# EAGLE schematic MotorAndLight (EAGLE 7.7.0)

## Sheet 1 of 7

## Sheet 2 of 7
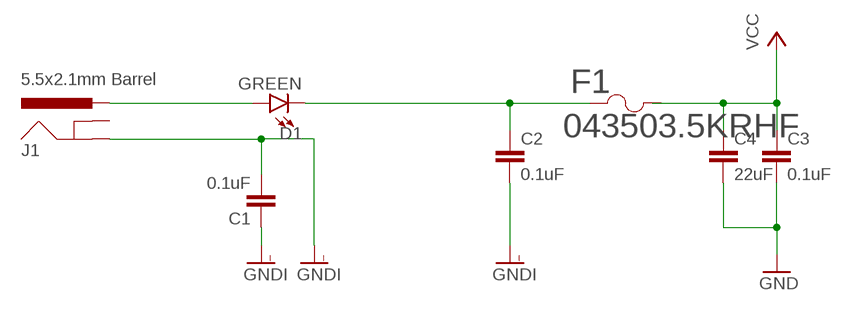
[diagram p0: schematic, sheet 2]

### Parts
C1  0.1uF  0.1UF-0603-25V-(+80/-20%)  [0603]
C2  0.1uF  0.1UF-0603-25V-(+80/-20%)  [0603]
C3  0.1uF  0.1UF-0603-25V-(+80/-20%)  [0603]
C4  22uF  22UF-0805-6.3V-20%  [0805]
D1  GREEN  LED-GREEN0603  [LED-0603]
F1  043503.5KRHF  [0435SERIES]
J1  5.5x2.1mm Barrel  POWER_JACKSMD  [POWER_JACK_SMD]

### Nets
GND: C3.2 C4.2 ; also sheet 4,5,6
GNDI: C1.1 C1.2 C2.2 J1.P$4(GND)
N$1: D1.A J1.VIN0(PWR)
N$4: C2.1 D1.C F1.1
VCC: C3.1 C4.1
Unconnected: F1.2 J1.GND(GNDBREAK)

## Sheet 3 of 7

## Sheet 4 of 7
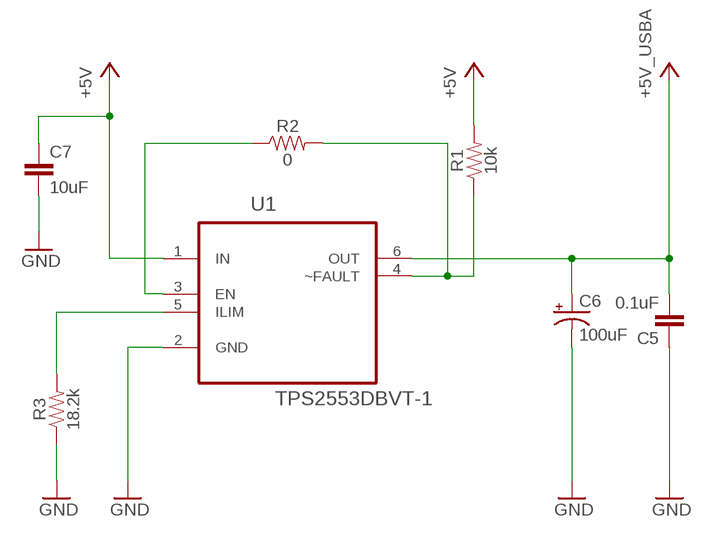
[diagram p1: schematic, sheet 4]

### Parts
C5  0.1uF  0.1UF-0603-25V-(+80/-20%)  [0603]
C6  100uF  100UF-POLAR-EIA7343-16V-10%(TANT)  [EIA7343]
C7  10uF  10UF-0603-6.3V-20%  [0603]
R1  10k  10KOHM-0603-1/10W-1%  [0603]
R2  0  0OHM-0603-1/10W-5%  [0603]
R3  18.2k  20KOHM-0603-1/10W-1%  [0603]
U1  TPS2553DBVT-1  [SOT95P280X145-6N]

### Nets
+5V: C5.2 C6.A(+) C7.1 R1.2 U1.1(IN) U1.6(OUT) ; supply symbol labelled +5V_USBA
GND: C5.1 C6.C(-) C7.2 R3.1 U1.2(GND) ; also sheet 2,5,6
N$6: R3.2 U1.5(ILIM)
USB3_CONN_EN: R2.1 U1.3(EN)
USB3_CONN_FLT: R1.1 R2.2 U1.4(~FAULT)

## Sheet 5 of 7
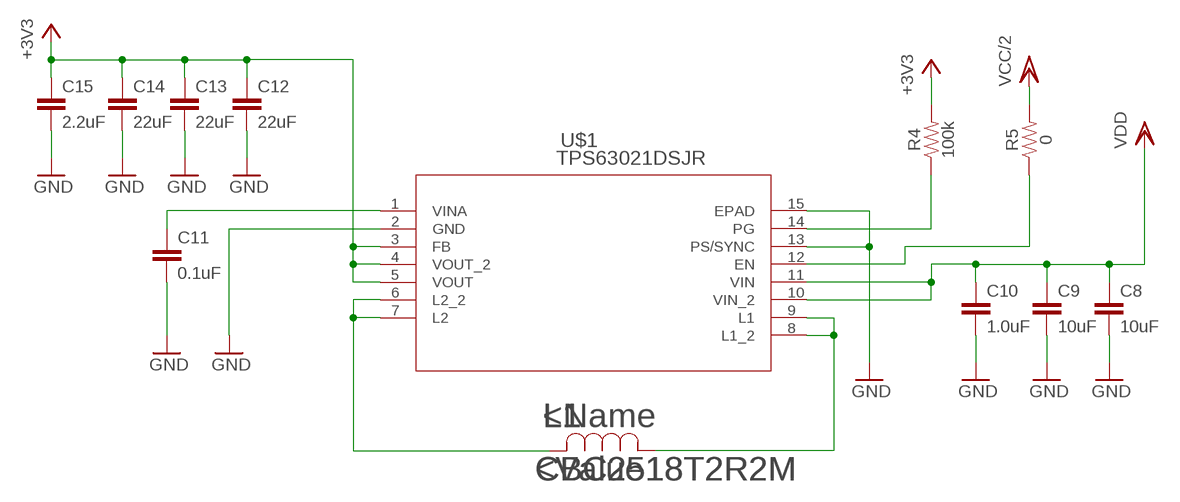
[diagram p2: schematic, sheet 5]

### Parts
C8  10uF  10UF-0603-6.3V-20%  [0603]
C9  10uF  10UF-0603-6.3V-20%  [0603]
C10  1.0uF  1.0UF-0603-16V-10%  [0603]
C11  0.1uF  0.1UF-0603-25V-(+80/-20%)  [0603]
C12  22uF  22UF-0805-6.3V-20%  [0805]
C13  22uF  22UF-0805-6.3V-20%  [0805]
C14  22uF  22UF-0805-6.3V-20%  [0805]
C15  2.2uF  2.2UF-0603-10V-20%  [0603]
L1  CBC2518T2R2M  [IND_TAIYO_CBC2518]
R4  100k  100KOHM-0603-1/10W-1%  [0603]
R5  0  0OHM-0603-1/10W-5%  [0603]
U$1  TPS63021DSJR  [DSJ14_2P85X1P58]

### Nets
+3.3V_SW_L1: L1.1 U$1.8(L1_2) U$1.9(L1)
+3.3V_SW_L2: L1.2 U$1.6(L2_2) U$1.7(L2)
+3.3V_VINA: C11.1 U$1.1(VINA)
+3V3: C12.1 C13.1 C14.1 C15.1 R4.2 U$1.3(FB) U$1.4(VOUT_2) U$1.5(VOUT)
EN_3V3: R5.1 U$1.12(EN)
GND: C8.2 C9.2 C10.2 C11.2 C12.2 C13.2 C14.2 C15.2 U$1.2(GND) U$1.13(PS/SYNC) U$1.15(EPAD) ; also sheet 2,4,6
PWRGOOD_3.3V: R4.1 U$1.14(PG)
VCC/2: R5.2
VDD: C8.1 C9.1 C10.1 U$1.10(VIN_2) U$1.11(VIN) ; also sheet 6

## Sheet 6 of 7
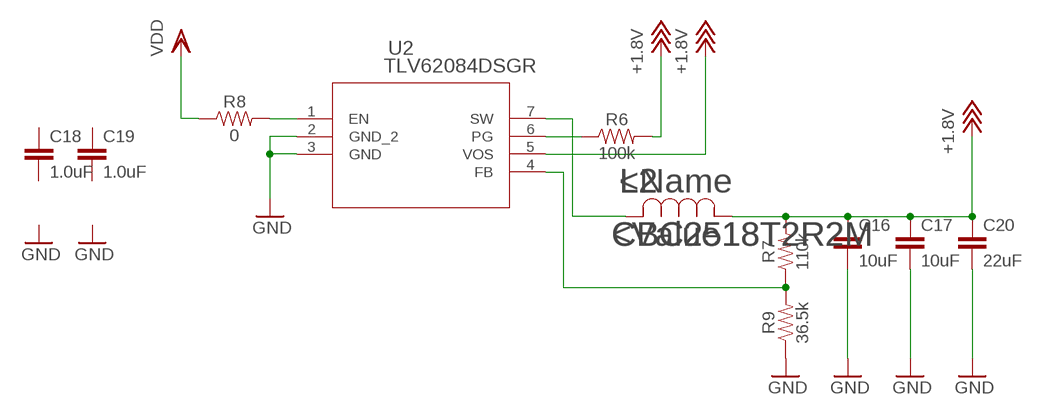
[diagram p3: schematic, sheet 6]

### Parts
C16  10uF  10UF-0603-6.3V-20%  [0603]
C17  10uF  10UF-0603-6.3V-20%  [0603]
C18  1.0uF  1.0UF-0603-16V-10%  [0603]
C19  1.0uF  1.0UF-0603-16V-10%  [0603]
C20  22uF  22UF-0805-6.3V-20%  [0805]
L2  CBC2518T2R2M  [IND_TAIYO_CBC2518]
R6  100k  100KOHM-0603-1/10W-1%  [0603]
R7  110k  100KOHM-0603-1/10W-1%  [0603]
R8  0  0OHM-0603-1/10W-5%  [0603]
R9  36.5k  33OHM-0603-1/10W-1%  [0603]
U2  TLV62084DSGR  [DSG8_0P9X1P6]

### Nets
+1.8V: C16.1 C17.1 C20.1 L2.1 R6.2 R7.2 U2.5(VOS)
GND: C16.2 C17.2 C20.2 R9.1 U2.2(GND_2) U2.3(GND) ; also sheet 2,4,5
N$2: R8.2 U2.1(EN)
N$3: R6.1 U2.6(PG)
N$5: L2.2 U2.7(SW)
N$7: R7.1 R9.2 U2.4(FB)
VDD: R8.1 ; also sheet 5
Unconnected: C18.1 C18.2 C19.1 C19.2

## Sheet 7 of 7

## Library data of the parts
C1-C3 C5 C11 = SparkFun-Capacitors:0.1UF: 0.1µF ceramic capacitors A capacitor is a passive two-terminal electrical component used to store electrical energy temporarily in an electric field.; PROD_ID: CAP-00810
C4 C12-C14 C20 = SparkFun-Capacitors:22UF: 22µF ceramic capacitors A capacitor is a passive two-terminal electrical component used to store electrical energy temporarily in an electric field.; PROD_ID: CAP-08402
C6 = SparkFun-Capacitors:100UF-POLAR: 100µF polarized capacitors A capacitor is a passive two-terminal electrical component used to store electrical energy temporarily in an electric field.; PROD_ID: CAP-08702
C7-C9 C16 C17 = SparkFun-Capacitors:10UF: 10.0µF ceramic capacitors A capacitor is a passive two-terminal electrical component used to store electrical energy temporarily in an electric field.; PROD_ID: CAP-11015
C10 C18 C19 = SparkFun-Capacitors:1.0UF: 1µF ceramic capacitors A capacitor is a passive two-terminal electrical component used to store electrical energy temporarily in an electric field.; PROD_ID: CAP-00868
C15 = SparkFun-Capacitors:2.2UF: 2.2µF ceramic capacitors A capacitor is a passive two-terminal electrical component used to store electrical energy temporarily in an electric field.; PROD_ID: CAP-07888
D1 = SparkFun-LED:LED-GREEN: Green SMD LED Used in manufacturing of various products at SparkFun Packages: 0603 - SMD 0603 package [Product Link] <http://www.futureelectronics.com/en/technologies/semiconductors/optoelectronics/leds/Pages/9894312-LTST-C190GKT.aspx?CrossPart=HSMG-C190&IM=0> LilyPad 1206 - SMD1206 LilyPad package [Product Link] <http://www.futureelectronics.com/en/Technologies/Product.aspx?ProductID=IN150NGHARVATEKCORPORATION2049943&IM=0> 1206 - SMD1206 package [Product Link] <http://www.futureelectronics.com/en/technologies/semiconductors/optoelectronics/leds/Pages/8315665-LTST-C150KGKT.aspx?IM=0> 1206 Bottom Mount -SMD 1206 Bottom Mount [Product Link] <http://www.digikey.com/product-detail/en/lite-on-inc/LTST-C230KGKT/160-1456-1-ND/386854> SparkFun Products: Pro Mini 328 -5V <https://www.sparkfun.com/products/821> RedBoard <https://www.sparkfun.com/products/12757> MP3 Trigger <https://www.sparkfun.com/products/13720> Makey Makey <https://www.sparkfun.com/products/11076>; PROD_ID: DIO-00821
F1 = DigiKey:043503.5KRHF; MANUFACTURER_PART_NUMBER: 043503.5KRHF; VENDOR: Littelfuse Inc
J1 = SparkFun-Connectors:POWER_JACK: Power Jack Connector This is the standard 5.5mm barrel jack for power. The PTH is the most common, proven, reliable, footprint. The Slot footprint only works if the mill layer is transmitted to the PCB fab house so be warned. Here are the connectors we sell at SparkFun: DC Barrel Power Jack/Connector <https://www.sparkfun.com/products/119> (PRT-00119) DC Barrel Power Jack/Connector (SMD) <https://www.sparkfun.com/products/12748> (PRT-12748) DC Barrel Jack Adapter - Breadboard Compatible <https://www.sparkfun.com/products/10811> (PRT-10811) It is used on this SparkFun product (and many, many others): SparkFun RedBoard - Programmed with Arduino <https://www.sparkfun.com/products/12757> (DEV-12757) Also, if you need a mating power supply or connector, please check these out: Wall Adapter Power Supply - 9VDC 650mA <https://www.sparkfun.com/products/298> (TOL-00298) DC Barrel Jack Adapter - Male <https://www.sparkfun.com/products/10287> (PRT-10287); PROD_ID: CONN-08106; SF_ID: PRT-12748
L1 L2 = DigiKey:CBC2518T2R2M; MANUFACTURER_PART_NUMBER: CBC2518T2R2M; VENDOR: TAIYO YUDEN
R1 = SparkFun-Resistors:10KOHM: 10kΩ resistor A resistor is a passive two-terminal electrical component that implements electrical resistance as a circuit element. Resistors act to reduce current flow, and, at the same time, act to lower voltage levels within circuits. - Wikipedia; PROD_ID: RES-00824
R2 R5 R8 = SparkFun-Resistors:0OHM: 0Ω resistor A resistor is a passive two-terminal electrical component that implements electrical resistance as a circuit element. Resistors act to reduce current flow, and, at the same time, act to lower voltage levels within circuits. - Wikipedia; PROD_ID: RES-08609
R3 = SparkFun-Resistors:20KOHM: 20kΩ resistor A resistor is a passive two-terminal electrical component that implements electrical resistance as a circuit element. Resistors act to reduce current flow, and, at the same time, act to lower voltage levels within circuits. - Wikipedia; PROD_ID: RES-09383; VALUE: 20k
R4 R6 = SparkFun-Resistors:100KOHM: 100kΩ resistor A resistor is a passive two-terminal electrical component that implements electrical resistance as a circuit element. Resistors act to reduce current flow, and, at the same time, act to lower voltage levels within circuits. - Wikipedia; PROD_ID: RES-07828
R7 = SparkFun-Resistors:100KOHM: 100kΩ resistor A resistor is a passive two-terminal electrical component that implements electrical resistance as a circuit element. Resistors act to reduce current flow, and, at the same time, act to lower voltage levels within circuits. - Wikipedia; PROD_ID: RES-07828; VALUE: 100k
R9 = SparkFun-Resistors:33OHM: 33Ω resistor A resistor is a passive two-terminal electrical component that implements electrical resistance as a circuit element. Resistors act to reduce current flow, and, at the same time, act to lower voltage levels within circuits. - Wikipedia; PROD_ID: RES-08270; VALUE: 33
U1 = Texas Instruments_By_element14_Batch_1:TPS2553DBVT-1: PRECISION ADJUSTABLE CURRENT-LIMITED POWER-DISTRIBUTION SWITCHES; MPN: TPS2553DBVT-1; OC_FARNELL: 1694426; OC_NEWARK: 40P3871; PACKAGE: SOT-23-6; SUPPLIER: Texas Instruments
U2 = DigiKey:TLV62084DSGR; MANUFACTURER_PART_NUMBER: tlv62084dsgr; VENDOR: Texas Instruments
U$1 = DigiKey:TPS63021DSJR; MANUFACTURER_PART_NUMBER: TPS63021DSJR; VENDOR: Texas Instruments